# Altium schematic sheet ECG_leptons.SchDoc
size A; SheetNumber: 1; SheetTotal: 1
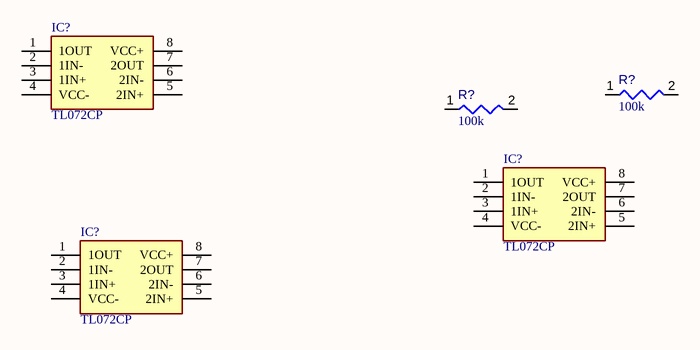
[diagram p0: ECG_leptons.SchDoc]

## Parts
(Parts that share a designator on the sheet are numbered #1, #2 ... from top to bottom, then left to right.)
IC?#1  TL072CP  [DIP794W53P254L959H508Q8N]
IC?#2  TL072CP  [DIP794W53P254L959H508Q8N]
IC?#3  TL072CP  [DIP794W53P254L959H508Q8N]
R?#1  value 100k  [RESC2013X70X40ML20T20]  (hidden comment: Resistor 100k +/-1% 0805 125 mW)
R?#2  value 100k  [RESC2013X70X40ML20T20]  (hidden comment: Resistor 100k +/-1% 0805 125 mW)

## Nets

Not connected (* = marked no-connect by the designer): IC?#1 1(1OUT) 2(1IN-) 3(1IN+) 4(VCC-) 5(2IN+) 6(2IN-) 7(2OUT) 8(VCC+); IC?#2 1(1OUT) 2(1IN-) 3(1IN+) 4(VCC-) 5(2IN+) 6(2IN-) 7(2OUT) 8(VCC+); IC?#3 1(1OUT) 2(1IN-) 3(1IN+) 4(VCC-) 5(2IN+) 6(2IN-) 7(2OUT) 8(VCC+); R?#1 1 2; R?#2 1 2

## Library data of the parts
IC?#1-IC?#3 = TL072CP: Integrated Circuit; Manufacturer_Name: Texas Instruments; Datasheet Link: http://www.ti.com/lit/ds/symlink/tl071a.pdf; Height: 5.08mm; Manufacturer_Part_Number: TL072CP; Mouser Part Number: 595-TL072CP; Mouser Price/Stock: https://www.mouser.co.uk/ProductDetail/Texas-Instruments/TL072CP?qs=5nGYs9Do7G3e6Tx9uHIgUA%3D%3D; Arrow Part Number: TL072CP; Arrow Price/Stock: https://www.arrow.com/en/products/tl072cp/texas-instruments?region=nac
R?#1 R?#2 = CMP-009-00024-5: Chip Resistor, 100 KOhm, +/- 1%, 0.125 W, -55 to 155 degC, 0805 (2012 Metric); Power: 125mW; Voltage Rating: 150V; Max Operating Temperature: 155°C; Mounting Technology: SM; RoHS Compliant: True; Tolerance: 1%; Case/Package: 0805; Min Operating Temperature: -55°C; Pins: 2